# Altium schematic sheet EvaluationCircuit.SCHDOC
size A4; Organization: Altium Limited; Address1: L3, 12a Rodborough Rd; Address2: Frenchs Forest; Address3: NSW; Address4: Australia 2086; DocumentNumber: 17; SheetNumber: 17; SheetTotal: 22
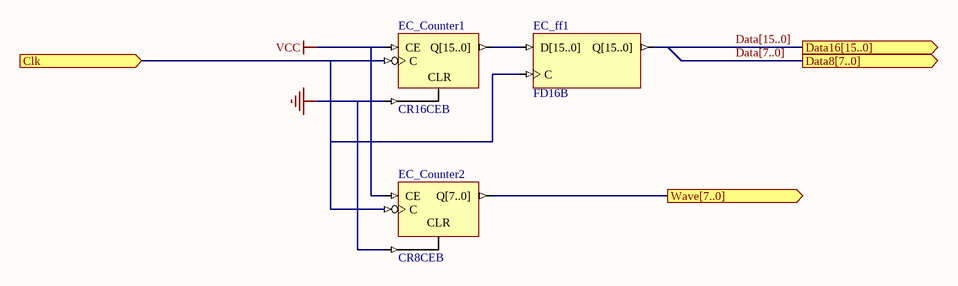
[diagram p0: EvaluationCircuit.SCHDOC]

## Parts
EC_Counter1  CR16CEB
EC_Counter2  CR8CEB
EC_ff1  FD16B

## Ports
Clk (in), Data8[7..0] (out), Data16[15..0] (out), Wave[7..0] (out)

## Nets
GND: EC_Counter1.CLR EC_Counter2.CLR
VCC: EC_Counter1.CE EC_Counter2.CE
Clk: EC_Counter1.C EC_Counter2.C EC_ff1.C ; port Clk
Data[15..0]: EC_ff1.Q[15..0] ; port Data16[15..0]
Wave[7..0]: EC_Counter2.Q[7..0] ; port Wave[7..0]
NetEC_Counter1_Q[15..0]: EC_Counter1.Q[15..0] EC_ff1.D[15..0]

## Buses and harness runs
bus Data[7..0] = port Data8[7..0]
bus Data[15..0] = port Data16[15..0]

## Notes on the sheet
- Title
- Size:
- Date:
- A4
- Number:
- Time:
- Revision:
- Sheet
- of
- File:

## Library data of the parts
EC_Counter1 = CR16CEB: 16-Bit Negative-Edge Binary Ripple Counters with Clock Enable and Asynchronous Clear, Bus Version; Xilinx Equivalent: CR16CE; ArchiveName: GENERIC; Published: 9-30-2003; Publisher: Altium Limited; Core Revision: 1.00.00
EC_Counter2 = CR8CEB: 8-Bit Negative-Edge Binary Ripple Counters with Clock Enable and Asynchronous Clear, Bus Version; Xilinx Equivalent: CR8CE; ArchiveName: GENERIC; Published: 9-30-2003; Publisher: Altium Limited; Core Revision: 1.00.00
EC_ff1 = FD16B: 16-Bit D-Type Flip-Flop, Bus Version; ArchiveName: GENERIC; Published: 9-30-2003; Publisher: Altium Limited; Core Revision: 1.00.00